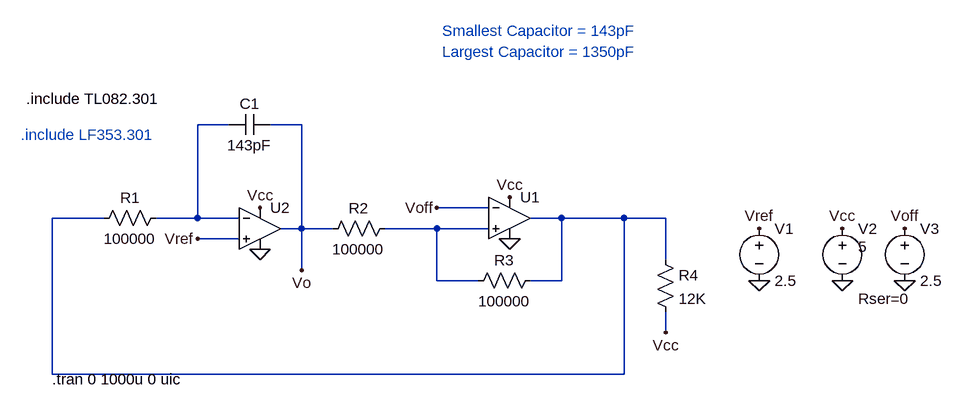
[diagram p0: schematic FM CCT.asc]
FM CCT.asc, the LTspice schematic file:
Version 4
SHEET 1 1092 680
WIRE -80 -32 -128 -32
WIRE 32 -32 -16 -32
WIRE 320 96 240 96
WIRE -272 112 -352 112
WIRE -128 112 -128 -32
WIRE -128 112 -192 112
WIRE -64 112 -128 112
WIRE 432 112 384 112
WIRE 528 112 432 112
WIRE 592 112 528 112
WIRE 32 128 32 -32
WIRE 32 128 0 128
WIRE 80 128 32 128
WIRE 240 128 160 128
WIRE 320 128 240 128
WIRE -64 144 -128 144
WIRE 592 176 592 112
WIRE 32 192 32 128
WIRE 240 208 240 128
WIRE 304 208 240 208
WIRE 432 208 432 112
WIRE 432 208 384 208
WIRE 592 288 592 256
WIRE -352 352 -352 112
WIRE 528 352 528 112
WIRE 528 352 -352 352
FLAG 736 208 0
FLAG 736 128 Vref
FLAG 864 208 0
FLAG 864 128 Vcc
FLAG -32 96 Vcc
FLAG -128 144 Vref
FLAG 240 96 Voff
FLAG 352 80 Vcc
FLAG 32 192 Vo
FLAG 960 208 0
FLAG 960 128 Voff
FLAG 592 288 Vcc
FLAG -32 160 0
FLAG 352 144 0
SYMBOL res 400 192 R90
WINDOW 0 0 56 VBottom 2
WINDOW 3 32 56 VTop 2
SYMATTR InstName R3
SYMATTR Value 100000
SYMBOL res 176 112 R90
WINDOW 0 0 56 VBottom 2
WINDOW 3 32 56 VTop 2
SYMATTR InstName R2
SYMATTR Value 100000
SYMBOL cap -16 -48 R90
WINDOW 0 0 32 VBottom 2
WINDOW 3 32 32 VTop 2
SYMATTR InstName C1
SYMATTR Value 143pF
SYMBOL res -176 96 R90
WINDOW 0 0 56 VBottom 2
WINDOW 3 32 56 VTop 2
SYMATTR InstName R1
SYMATTR Value 100000
SYMBOL voltage 736 112 R0
WINDOW 39 0 0 Left 0
SYMATTR Value2 AC 0.001
SYMATTR InstName V1
SYMATTR Value 2.5
SYMBOL voltage 864 112 R0
WINDOW 123 0 0 Left 0
WINDOW 39 24 124 Left 2
WINDOW 3 24 44 Left 2
SYMATTR SpiceLine Rser=0
SYMATTR Value 5
SYMATTR InstName V2
SYMBOL voltage 960 112 R0
WINDOW 39 0 0 Left 0
SYMATTR Value2 AC 0.001
SYMATTR InstName V3
SYMATTR Value 2.5
SYMBOL res 576 160 R0
SYMATTR InstName R4
SYMATTR Value 12K
SYMBOL opamp2 352 48 R0
SYMATTR InstName U1
SYMATTR Value ""
SYMATTR SpiceModel TL082
SYMBOL opamp2 -32 64 R0
SYMATTR InstName U2
SYMATTR Value ""
SYMATTR SpiceModel TL082
TEXT -352 360 Left 2 !.tran 0 1000u 0 uic
TEXT 248 -176 Left 2 ;Smallest Capacitor = 143pF
TEXT 248 -144 Left 2 ;Largest Capacitor = 1350pF
TEXT -400 -16 Left 2 ;.include LF353.301
TEXT -392 -72 Left 2 !.include TL082.301

The netlist it stands for:
* FM CCT.asc
R3 N002 N003 100000
R2 N003 Vo 100000
C1 Vo N001 143pF
R1 N001 N002 100000
V1 Vref 0 2.5 AC 0.001
V2 Vcc 0 5 Rser=0
V3 Voff 0 2.5 AC 0.001
R4 N002 Vcc 12K
XU1 N003 Voff Vcc 0 N002 TL082  ; pins In+ In- V+ V- OUT
XU2 Vref N001 Vcc 0 Vo TL082  ; pins In+ In- V+ V- OUT
.tran 0 1000u 0 uic
* Smallest Capacitor = 143pF
* Largest Capacitor = 1350pF
* .include LF353.301
.include TL082.301
.backanno
.end